# Altium schematic sheet ADC2.SchDoc
size A; SheetNumber: 11; SheetTotal: 11
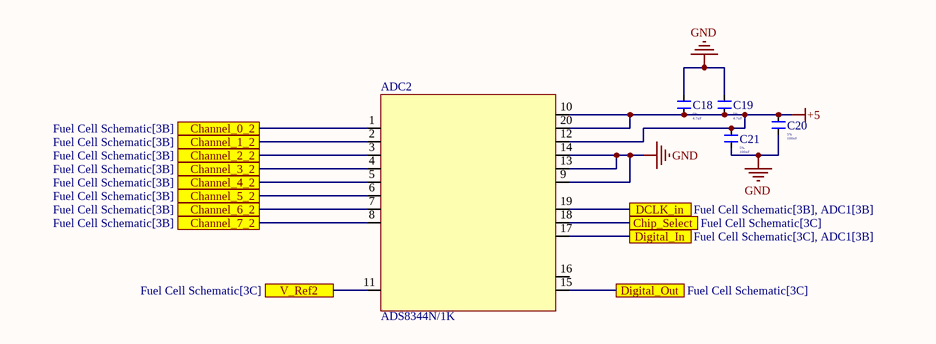
[diagram p0: ADC2.SchDoc]

## Parts
ADC2  ADS8344N/1K  [ADS8344]
C18  Tolerance: 5%  Capacitance: 4.7uF  [Capacitor_Kemet_0805]
C19  Tolerance: 5%  Capacitance: 4.7uF  [Capacitor_Kemet_0805]
C20  Dissipation Factor: 5%  Capacitance: 100nF  [Capacitor_Kemet_0805]
C21  Dissipation Factor: 5%  Capacitance: 100nF  [Capacitor_Kemet_0805]

## Ports
Channel_0_2 (see Fuel Cell Schematic[3B]), Channel_1_2 (see Fuel Cell Schematic[3B]), Channel_2_2 (see Fuel Cell Schematic[3B]), Channel_3_2 (see Fuel Cell Schematic[3B]), Channel_4_2 (see Fuel Cell Schematic[3B]), Channel_5_2 (see Fuel Cell Schematic[3B]), Channel_6_2 (see Fuel Cell Schematic[3B]), Channel_7_2 (see Fuel Cell Schematic[3B]), Chip_Select (see Fuel Cell Schematic[3C]), DCLK_in (see Fuel Cell Schematic[3B], ADC1[3B]), Digital_In (see Fuel Cell Schematic[3C], ADC1[3B]), Digital_Out (see Fuel Cell Schematic[3C]), V_Ref2 (see Fuel Cell Schematic[3C])

## Nets
+5: ADC2.10(Shutdown) ADC2.12(+VCC) ADC2.20(+VCC) C18.1 C19.1 C20.2 C21.2
GND: ADC2.9(Common_Reference) ADC2.13(Ground) ADC2.14(Ground) C18.2 C19.2 C20.1 C21.1
Channel_0_2: ADC2.1(Channel_0) ; port Channel_0_2
Channel_1_2: ADC2.2(Channel_1) ; port Channel_1_2
Channel_2_2: ADC2.3(Channel_2) ; port Channel_2_2
Channel_3_2: ADC2.4(Channel_3) ; port Channel_3_2
Channel_4_2: ADC2.5(Channel_4) ; port Channel_4_2
Channel_5_2: ADC2.6(Channel_5) ; port Channel_5_2
Channel_6_2: ADC2.7(Channel_6) ; port Channel_6_2
Channel_7_2: ADC2.8(Channel_7) ; port Channel_7_2
Chip_Select: ADC2.18(Chip_Select) ; port Chip_Select
DCLK_in: ADC2.19(Digital_Clock) ; port DCLK_in
Digital_In: ADC2.17(Digital_In) ; port Digital_In
Digital_Out: ADC2.15(Digital_Out) ; port Digital_Out
V_Ref2: ADC2.11(V_Reference) ; port V_Ref2

Not connected (* = marked no-connect by the designer): ADC2 16(Busy)

## Library data of the parts
ADC2 = ADS8344N/1K: IC ADC 16BIT SAR 20SSOP; Manufacturer: Texas Instruments; Nominal Supply Current: 1.5mA; Min Supply Voltage: 2.7V; Max Supply Voltage: 5.25V; Max Power Dissipation: 10mW; Interface: Serial; Number of Bits: 16; Sampling Rate: 100KS/s; Number of Converters: 1; Resolution: 16b; Polarity: Unipolar; Number of Inputs: 8; Integral Nonlinearity (INL): 6LSB; Spurious-free dynamic range (SFDR): 92dB; Power Consumption: 3.6mW; Supply Type: Single; Differential Nonlinearity: 2LSB; Power Dissipation: 7.5mW; Operating Supply Voltage: 5V; Supplier 1: Digi-Key; Manufacturer Part Number: ADS8344N/1K; RoHS: Yes; Category: Analog to Digital Converters (ADCs); Stock 1: 1147; Pricing 1: 1=18.10000, 10=16.63400, 25=15.94480, 100=14.04870, 250=13.35924, 500=13.00960 (USD); Case/Package: SSOP; Number of Pins: 20; Contact Plating: Gold; Min Operating Temperature: -40°C; Max Operating Temperature: 85°C; Packaging: Tape and Reel; Package Quantity: 1000; Number of A/D Converters: 1; Conversion Rate: 100KS/s; Max Supply Voltage (DC): 5.25V; Min Supply Voltage (DC): 2.7V; Series: -; Supply Current: 1.5mA; REACH SVHC: No SVHC; Lead Free: Lead Free; RoHS Compliant: Yes; ComponentLink1URL: https://datasheet.ciiva.com/4031/2422049s9164356n7713-4031078.pdf?src-supplier=Arrow+Electronics; ComponentLink1Description: https://datasheet.ciiva.com/4031/2422049s9164356n7713-4031078.pdf?src-supplier=Arrow+Electronics; ComponentLink2URL: https://datasheet.ciiva.com/1308/ads8344-1308384.pdf?src-supplier=Digi-Key; ComponentLink2Description: https://datasheet.ciiva.com/1308/ads8344-1308384.pdf?src-supplier=Digi-Key; Supplier Part Number 1: 296-41197-1-ND
C18 C19 = C0805C475J4RACAUTO: CAP CER 4.7UF 16V X7R 0805; Manufacturer: KEMET; Supplier 1: Digi-Key; RoHS: Yes; Category: Ceramic Capacitors; Stock 1: 16673; Pricing 1: 1=0.56000, 10=0.39300, 50=0.29680, 100=0.25850, 500=0.19150, 1000=0.16277 (USD); Mount: Surface Mount; Case/Package: 0805; Min Operating Temperature: -55°C; Max Operating Temperature: 125°C; Packaging: Tape and Reel; Voltage Rating: 16V; Ratings: AEC-Q200; RoHS Compliant: Yes; ComponentLink1URL: http://www.farnell.com/datasheets/2741387.pdf?src-supplier=Farnell; ComponentLink1Description: http://www.farnell.com/datasheets/2741387.pdf?src-supplier=Farnell; ComponentLink2URL: https://api.kemet.com/component-edge/download/datasheet/C0805C475J4RACAUTO.pdf?src-supplier=Digi-Key; ComponentLink2Description: https://api.kemet.com/component-edge/download/datasheet/C0805C475J4RACAUTO.pdf?src-supplier=Digi-Key; ComponentLink3URL: http://www.farnell.com/datasheets/2741387.pdf?src-supplier=Newark; ComponentLink3Description: http://www.farnell.com/datasheets/2741387.pdf?src-supplier=Newark; Supplier Part Number 1: 399-15716-1-ND; Manufacturer Part Number: C0805C475J4RACAUTO
C20 C21 = C0805C104J4RACTU: Cap Ceramic 0.1uF 16V X7R 5% SMD 0805 125°C Plastic T/R; Manufacturer: KEMET; Supplier 1: Digi-Key; Manufacturer Part Number: C0805C104J4RACTU; RoHS: Yes; Category: Ceramic Capacitors; Stock 1: 21669; Pricing 1: 1=0.53000, 10=0.37300, 50=0.28180, 100=0.24540, 500=0.18180, 1000=0.15453 (USD); Mount: Surface Mount; Case/Package: 0805; Case Code (Imperial): 0805; Case Code (Metric): 2012; Dielectric Material: Ceramic; Min Operating Temperature: -55°C; Max Operating Temperature: 125°C; Package Quantity: 4000; Packaging: Tape and Reel; Voltage Rating: 16V; Voltage Rating (DC): 16V; Dielectric: X7R; Termination: SMD/SMT; Series: -; Length: 2mm; Width: 1.2mm; Height: 0.9mm; Lead Pitch: 0.75mm; Thickness: 0.035inch; Depth: 1.25mm; RoHS Compliant: Yes; ComponentLink1URL: http://www.farnell.com/datasheets/2746326.pdf?src-supplier=Farnell; ComponentLink1Description: http://www.farnell.com/datasheets/2746326.pdf?src-supplier=Farnell; ComponentLink2URL: http://www.farnell.com/datasheets/2323359.pdf?src-supplier=Farnell; ComponentLink2Description: http://www.farnell.com/datasheets/2323359.pdf?src-supplier=Farnell; ComponentLink3URL: http://www.mouser.com/ds/2/212/KEM_C1002_X7R_SMD-1102033.pdf?src-supplier=Mouser; ComponentLink3Description: http://www.mouser.com/ds/2/212/KEM_C1002_X7R_SMD-1102033.pdf?src-supplier=Mouser; ComponentLink4URL: http://components.arrow.com/part/dataview/3452184S4481915N7429?src-supplier=Arrow+Electronics; ComponentLink4Description: http://components.arrow.com/part/dataview/3452184S4481915N7429?src-supplier=Arrow+Electronics; ComponentLink5URL: https://api.kemet.com/component-edge/download/datasheet/C0805C104J4RACTU.pdf?src-supplier=Digi-Key; ComponentLink5Description: https://api.kemet.com/component-edge/download/datasheet/C0805C104J4RACTU.pdf?src-supplier=Digi-Key; ComponentLink6URL: http://www.farnell.com/datasheets/2330568.pdf?src-supplier=Newark; ComponentLink6Description: http://www.farnell.com/datasheets/2330568.pdf?src-supplier=Newark; ComponentLink7URL: http://www.farnell.com/datasheets/2746326.pdf?src-supplier=Newark; ComponentLink7Description: http://www.farnell.com/datasheets/2746326.pdf?src-supplier=Newark; Supplier Part Number 1: 399-C0805C104J4RAC7800CT-ND